# Altium project T1-T0ast.X1.PrjPcb (part 2 of 2)

## Sheet USB3_Replication.SchDoc
size B; SheetNumber: 9; SheetTotal: 9
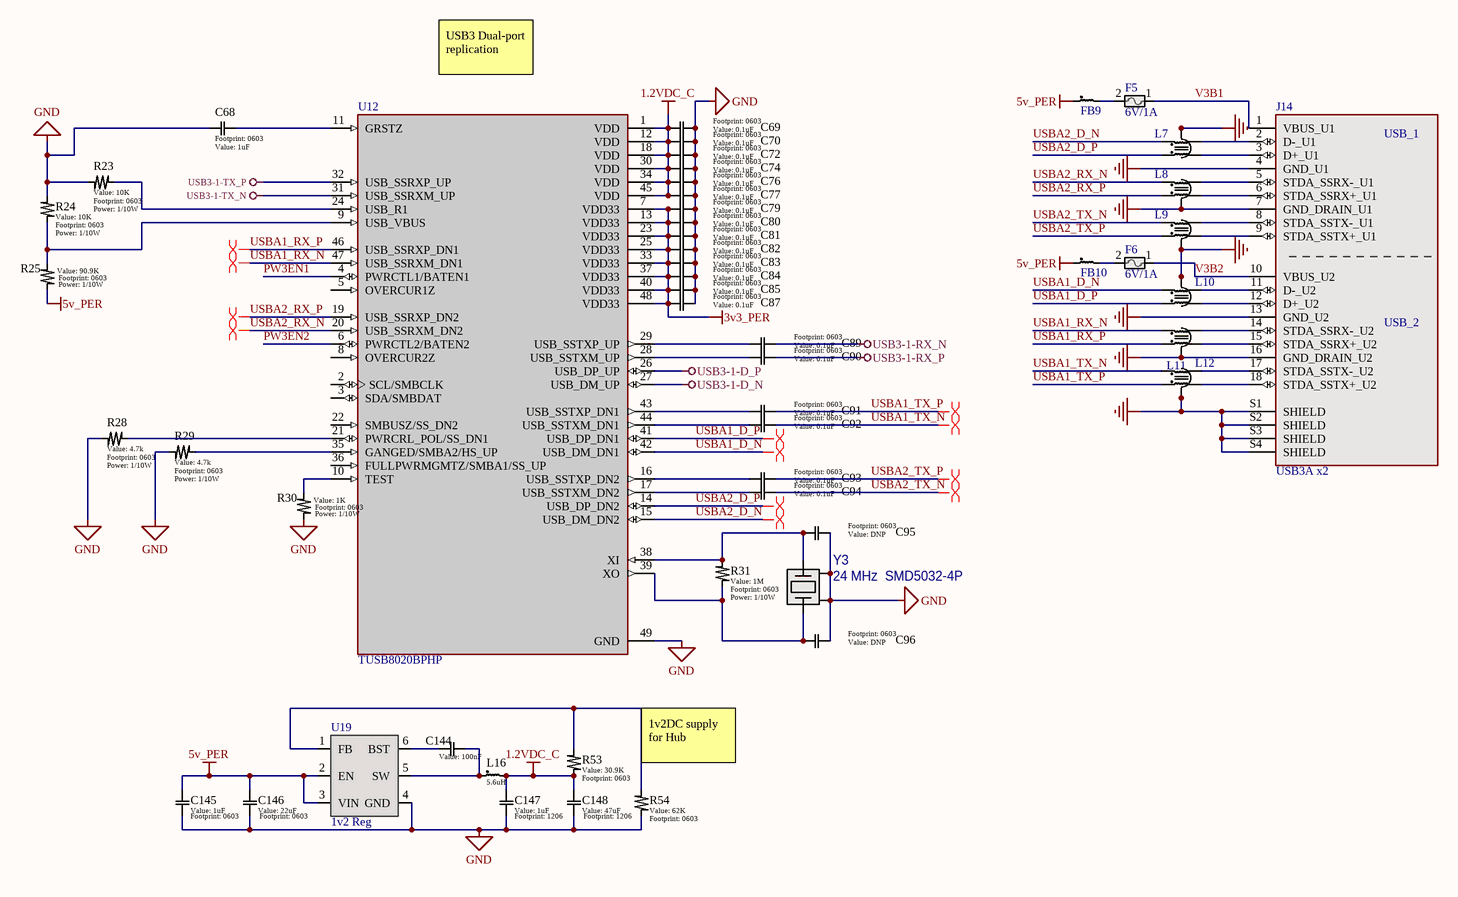
[diagram p5: USB3_Replication.SchDoc]

### Parts
C68  value 1uF  [0603]  (hidden comment: Generic Capacitor)
C69  value 0.1uF  [0603]  (hidden comment: Generic Capacitor)
C70  value 0.1uF  [0603]  (hidden comment: Generic Capacitor)
C72  value 0.1uF  [0603]  (hidden comment: Generic Capacitor)
C74  value 0.1uF  [0603]  (hidden comment: Generic Capacitor)
C76  value 0.1uF  [0603]  (hidden comment: Generic Capacitor)
C77  value 0.1uF  [0603]  (hidden comment: Generic Capacitor)
C79  value 0.1uF  [0603]  (hidden comment: Generic Capacitor)
C80  value 0.1uF  [0603]  (hidden comment: Generic Capacitor)
C81  value 0.1uF  [0603]  (hidden comment: Generic Capacitor)
C82  value 0.1uF  [0603]  (hidden comment: Generic Capacitor)
C83  value 0.1uF  [0603]  (hidden comment: Generic Capacitor)
C84  value 0.1uF  [0603]  (hidden comment: Generic Capacitor)
C85  value 0.1uF  [0603]  (hidden comment: Generic Capacitor)
C87  value 0.1uF  [0603]  (hidden comment: Generic Capacitor)
C89  value 0.1uF  [0603]  (hidden comment: Generic Capacitor)
C90  value 0.1uF  [0603]  (hidden comment: Generic Capacitor)
C91  value 0.1uF  [0603]  (hidden comment: Generic Capacitor)
C92  value 0.1uF  [0603]  (hidden comment: Generic Capacitor)
C93  value 0.1uF  [0603]  (hidden comment: Generic Capacitor)
C94  value 0.1uF  [0603]  (hidden comment: Generic Capacitor)
C95  value DNP  [0603]  (hidden comment: Generic Capacitor)
C96  value DNP  [0603]  (hidden comment: Generic Capacitor)
C144  value 100nF  [0603]  (hidden comment: Generic Capacitor)
C145  value 1uF  [0603]  (hidden comment: Generic Capacitor)
C146  value 22uF  [0603]  (hidden comment: Generic Capacitor)
C147  value 1uF  [1206]  (hidden comment: Generic Capacitor)
C148  value 47uF  [1206]  (hidden comment: Generic Capacitor)
F5  6V/1A  [0805]
F6  6V/1A  [0805]
FB9  0603 Ferrite  [0603]  (value not drawn)
FB10  0603 Ferrite  [0603]  (value not drawn)
J14  USB3A x2  [0484060003]
L7  2CH CMC  [SMD-6-2CH]  (value not drawn)
L8  2CH CMC  [SMD-6-2CH]  (value not drawn)
L9  2CH CMC  [SMD-6-2CH]  (value not drawn)
L10  2CH CMC  [SMD-6-2CH]  (value not drawn)
L11  2CH CMC  [SMD-6-2CH]  (value not drawn)
L12  2CH CMC  [SMD-6-2CH]  (value not drawn)
L16  5.6uH  [TMPC0402HP]
R23  value 10K  Power: 1/10W  [0603]  (hidden comment: Generic Resistor)
R24  value 10K  Power: 1/10W  [0603]  (hidden comment: Generic Resistor)
R25  value 90.9K  Power: 1/10W  [0603]  (hidden comment: Generic Resistor)
R28  value 4.7k  Power: 1/10W  [0603]  (hidden comment: Generic Resistor)
R29  value 4.7k  Power: 1/10W  [0603]  (hidden comment: Generic Resistor)
R30  value 1K  Power: 1/10W  [0603]  (hidden comment: Generic Resistor)
R31  value 1M  Power: 1/10W  [0603]  (hidden comment: Generic Resistor)
R53  value 30.9K  [0603]  (hidden comment: Generic Resistor)
R54  value 62K  [0603]  (hidden comment: Generic Resistor)
U12  TUSB8020BPHP  [HTQFP-48(7x7)]
U19  1v2 Reg  [TSOT-23-6]
Y3  24 MHz  SMD5032-4P  [ECS-240-18-30BQ-DS]

### Nets
1.2VDC_C: C69.2 C70.2 C72.2 C74.2 C76.2 C77.2 C147.1 C148.1 L16.2 R53.1 U12.1(VDD) U12.12(VDD) U12.18(VDD) U12.30(VDD) U12.34(VDD) U12.45(VDD)
3v3_PER: C79.2 C80.2 C81.2 C82.2 C83.2 C84.2 C85.2 C87.2 U12.7(VDD33) U12.13(VDD33) U12.23(VDD33) U12.25(VDD33) U12.33(VDD33) U12.37(VDD33) U12.40(VDD33) U12.48(VDD33)
5v_PER: C145.1 C146.1 FB9.1 FB10.1 R25.1 U19.2(EN) U19.3(VIN)
GND: C68.1 C69.1 C70.1 C72.1 C74.1 C76.1 C77.1 C79.1 C80.1 C81.1 C82.1 C83.1 C84.1 C85.1 C87.1 C95.1 C96.1 C145.2 C146.2 C147.2 C148.2 J14.4(GND_U1) J14.7(GND_DRAIN_U1) J14.13(GND_U2) J14.16(GND_DRAIN_U2) J14.S1(SHIELD) J14.S2(SHIELD) J14.S3(SHIELD) J14.S4(SHIELD) L7.5 L7.6 L8.5 L8.6 L9.5 L9.6 L10.5 L10.6 L11.5 L11.6 L12.5 L12.6 R23.1 R24.1 R28.1 R29.1 R30.1 R54.1 U12.49(GND) U19.4(GND) Y3.2(GND) Y3.4(GND)
USB3-1-D_N: U12.27(USB_DM_UP)
USB3-1-D_P: U12.26(USB_DP_UP)
USB3-1-RX_N: C89.1
USB3-1-RX_P: C90.1
USB3-1-TX_N: U12.31(USB_SSRXM_UP)
USB3-1-TX_P: U12.32(USB_SSRXP_UP)
PW3EN1: U12.4(PWRCTL1/BATEN1)
PW3EN2: U12.6(PWRCTL2/BATEN2)
USBA1_D_N: L10.2 U12.42(USB_DM_DN1)
USBA1_D_P: L10.1 U12.41(USB_DP_DN1)
USBA1_RX_N: L11.1 U12.47(USB_SSRXM_DN1)
USBA1_RX_P: L11.2 U12.46(USB_SSRXP_DN1)
USBA1_TX_N: C92.1 L12.1
USBA1_TX_P: C91.1 L12.2
USBA2_D_N: L7.2 U12.15(USB_DM_DN2)
USBA2_D_P: L7.1 U12.14(USB_DP_DN2)
USBA2_RX_N: L8.1 U12.20(USB_SSRXM_DN2)
USBA2_RX_P: L8.2 U12.19(USB_SSRXP_DN2)
USBA2_TX_N: C94.1 L9.1
USBA2_TX_P: C93.1 L9.2
V3B1: F5.1 J14.1(VBUS_U1)
V3B2: F6.1 J14.10(VBUS_U2)
NetC68_2: C68.2 U12.11(GRSTZ)
NetC89_2: C89.2 U12.29(USB_SSTXP_UP)
NetC90_2: C90.2 U12.28(USB_SSTXM_UP)
NetC91_2: C91.2 U12.43(USB_SSTXP_DN1)
NetC92_2: C92.2 U12.44(USB_SSTXM_DN1)
NetC93_2: C93.2 U12.16(USB_SSTXP_DN2)
NetC94_2: C94.2 U12.17(USB_SSTXM_DN2)
NetC95_2: C95.2 R31.1 U12.38(XI) Y3.3
NetC96_2: C96.2 R31.2 U12.39(XO) Y3.1
NetC144_1: C144.1 U19.6(BST)
NetC144_2: C144.2 L16.1 U19.5(SW)
NetF5_2: F5.2 FB9.2
NetF6_2: F6.2 FB10.2
NetJ14_2: J14.2(D-_U1) L7.3
NetJ14_3: J14.3(D+_U1) L7.4
NetJ14_5: J14.5(STDA_SSRX-_U1) L8.4
NetJ14_6: J14.6(STDA_SSRX+_U1) L8.3
NetJ14_8: J14.8(STDA_SSTX-_U1) L9.4
NetJ14_9: J14.9(STDA_SSTX+_U1) L9.3
NetJ14_11: J14.11(D-_U2) L10.3
NetJ14_12: J14.12(D+_U2) L10.4
NetJ14_14: J14.14(STDA_SSRX-_U2) L11.4
NetJ14_15: J14.15(STDA_SSRX+_U2) L11.3
NetJ14_17: J14.17(STDA_SSTX-_U2) L12.4
NetJ14_18: J14.18(STDA_SSTX+_U2) L12.3
NetR23_2: R23.2 U12.24(USB_R1)
NetR24_2: R24.2 R25.2 U12.9(USB_VBUS)
NetR28_2: R28.2 U12.21(PWRCRL_POL/SS_DN1)
NetR29_2: R29.2 U12.35(GANGED/SMBA2/HS_UP)
NetR30_2: R30.2 U12.10(TEST)
NetR53_2: R53.2 R54.2 U19.1(FB)

Not connected (* = marked no-connect by the designer): U12 2(SCL/SMBCLK) 3(SDA/SMBDAT) 5(OVERCUR1Z) 8(OVERCUR2Z) 22(SMBUSZ/SS_DN2) 36(FULLPWRMGMTZ/SMBA1/SS_UP)

### Layout directives
differential pair: USBA1_D_N, USBA1_D_P, USBA1_RX_N, USBA1_RX_P, USBA1_TX_N, USBA1_TX_P, USBA2_D_N, USBA2_D_P, USBA2_RX_N, USBA2_RX_P, USBA2_TX_N, USBA2_TX_P

### Notes on the sheet
- USB3 Dual-port replication
- (near R54) 1v2DC supply for Hub
- REV
- REVISIONS
- DATE
- DESCRIPTION
- BY
- UNLESS OTHERWISE SPECIFIED, DRAWING DEFINITIONS AND TOLERANCES SHALL BE FOUND UNDER SUPPLIER STANDARDS SS-001. THIS PART AND ALL COMPONENTS OF IT MUST BE RoHS & REACH COMPLIANT. A CERTIFICATE OF COMPLIANCE MUST BE PROVIDED UPON REQUEST.
- ALL INFORMATION ON THIS DOCUMENT IS THE SOLE PROPERTY OF GAMBER-JOHNSON AND SHALL NOT BE COPIED, REPRODUCED, USED OR DISCLOSED IN WHOLE OR IN PART WITHOUT THE WRITTEN CONSENT OF GAMBER-JOHNSON
- TOLERANCES
  .00 ± .060
  .000 ± .020
  .0000 ± .005
  ANGELS ± 1°
- DRAWN BY:
- PROJECT NUMBER:
- SHEET TITLE:
- SHEET
- OF
- DATE:
- LOCATION:
- ASSEMBLY NUMBER
- SIZE
- GAMBER-JOHNSON LLC
  5001 JOERNS DR.
  STEVENS POINT, WI 54481
  +1 (715) 344-5209
- B
- (in symbol 0484060003) USB_1; USB_2

### Library data of the parts
C68 C95 C96 C144-C148 = Generic Capacitor: Voltage: >10V; Tolerance: 10%
C69 C70 C72 C74 C76 C77 C79-C85 C87 C89-C94 = Generic Capacitor: Voltage: 10V; Tolerance: 10%
F5 F6 = 0ZCK0100FF2E: Polymeric PTC Resettable Fuse 6V 1 A Ih Surface Mount 0805 (2012 Metric), Concave; Manufacturer: Bel; Max Current Rating: 40A; Hold Current: 1A; Trip Current: 1.95A; Time to Trip: 0.3s; Supplier 1: Digi-Key; Supplier Part Number 1: 507-1815-1-ND; Manufacturer Part Number: 0ZCK0100FF2E; RoHS: Yes; Category: PTC Resettable Fuses; Stock 1: 74738; Pricing 1: 1=0.27000, 5=0.26600, 10=0.25400, 50=0.22620, 100=0.21060, 250=0.18720, 500=0.15600, 1000=0.14820 (USD); Mount: Surface Mount; Case/Package: 0805; Case Code (Metric): 2012; Case Code (Imperial): 0805; Contact Plating: Tin,Matte; Min Operating Temperature: -40°C; Max Operating Temperature: 85°C; Package Quantity: 1; Packaging: Tape and Reel; RoHS Compliant: Yes; ComponentLink1URL: https://datasheet.ciiva.com/18550/0zck-18550620.pdf?src-supplier=Digi-Key; ComponentLink1Description: https://datasheet.ciiva.com/18550/0zck-18550620.pdf?src-supplier=Digi-Key; ComponentLink2URL: https://datasheet.ciiva.com/18550/0zck-18550621.pdf?src-supplier=Digi-Key; ComponentLink2Description: https://datasheet.ciiva.com/18550/0zck-18550621.pdf?src-supplier=Digi-Key; ComponentLink3URL: https://datasheet.ciiva.com/18550/0zck-18550622.pdf?src-supplier=Digi-Key; ComponentLink3Description: https://datasheet.ciiva.com/18550/0zck-18550622.pdf?src-supplier=Digi-Key; LCSC PN: C883112
FB9 FB10 = PE-0603FB121ST: 120 Ohms @ 100 MHz 1 Signal Line Ferrite Bead 0603 (1608 Metric) 500mA 180mOhm; Manufacturer: Pulse; Number of Lines: 1; DC Resistance (DCR): 180mR; Supplier 1: Digi-Key; Supplier Part Number 1: 553-2382-1-ND; Manufacturer Part Number: PE-0603FB121ST; RoHS: Yes; Category: Inductors; Stock 1: 6181; Pricing 1: 1=0.10000, 10=0.04400, 25=0.03920, 50=0.03580, 100=0.03220, 250=0.02360, 500=0.01716, 1000=0.01680 (USD); Mount: Surface Mount; Case/Package: 0603; Case Code (Metric): 1608; Case Code (Imperial): 0603; Min Operating Temperature: -40°C; Max Operating Temperature: 105°C; Package Quantity: 4000; Packaging: Tape and Reel; Max Current Rating: 500mA; Length: 0.063inch; Width: 0.031inch; Height: 0.037inch; RoHS Compliant: Yes; ComponentLink1URL: https://productfinder.pulseeng.com/doc_type/WEB301/doc_num/WC706/doc_part/WC706.pdf?src-supplier=Digi-Key; ComponentLink1Description: https://productfinder.pulseeng.com/doc_type/WEB301/doc_num/WC706/doc_part/WC706.pdf?src-supplier=Digi-Key; ComponentLink2URL: http://productfinder.pulseeng.com/products/datasheets/WC706.pdf?src-supplier=Digi-Key; ComponentLink2Description: http://productfinder.pulseeng.com/products/datasheets/WC706.pdf?src-supplier=Digi-Key; LCSC PN: C275486
J14 = 0484060003: USB-A _USB TYPE-A_, Stacked USB 3.0 _USB 3.1 Gen 1, Superspeed_ Receptacle Connector 18 Position Through Hole, Right Angle; MF: Molex; Package: None; MP: 0484060003; Price: None; Availability: Unavailable; Value: *; SnapEDA_Link: https://www.snapeda.com/parts/0484060003/Molex/view-part/424547/?ref=snap; LCSC PN: C2895028
L7-L12 = ICMEF112P350MFR: 35Ω@100MHz -40℃~+85℃ 4Ω 5V 2 100mA SMD Common Mode Filters ROHS; LCSC PN: C396460; Supplier 1: Mouser; Supplier Part Number 1: 710-748020024
L16 = TMPC0402HP-5R6MG-Z02: 2A 5.6uH ±20% SMD Power Inductor; LCSC PN: C357137; Supplier 1: Digi-Key; Supplier Part Number 1: 732-3339-1-ND
R23-R25 R28-R31 = Generic Resistor: Tolerance: 1%
R53 R54 = Generic Resistor: Tolerance: 1%; Power: 1/10W
U12 = TUSB8020BPHP: USB Hub Controller USB 3.0; LCSC PN: C205982; Supplier 1: Mouser; Supplier Part Number 1: 595-TUSB8020BPHP
U19 = AP63201WU-7: Step-down type Adjustable 2A 1.2V~12V 3.8V~32V TSOT-23-6 DC-DC Converter; LCSC PN: C2071044; Supplier 1: Future Electronics; Supplier Part Number 1: 5109504
Y3 = CMP-018-000001-1: 24 MHz ±30ppm Crystal 18pF 30 Ohms 4-SMD, No Lead; Pin Count: 4; Design Item ID: ECS-240-18-30BQ-DS; Component Type: Standard; Source: Misc ICs.SchLib; LCSC PN: C251601

## Nets that join several sheets
1v8_PO: Power_Regulation (PWR.4), HDMI (C20.1 U13.11)
3v3_PER: Power_Regulation (6 pins), USB_SATA (54 pins), USB3_Replication (16 pins)
3v3_PO: Power_Regulation (R1.1), SD_Card (R61.1 U24.5)
5v_PER: Power_Regulation (5 pins), HDMI (F7.2 F8.2), USB_SATA (17 pins), USB3_Replication (7 pins)
12v_PER: Power_Regulation (FB26.1 FB28.1), USB_SATA (6 pins)
GND: Power_Regulation (25 pins), HDMI (31 pins), USB_SATA (103 pins), SD_Card (7 pins), USB3_Replication (51 pins)